# EAGLE design breadboard_isp (EAGLE 6.1)
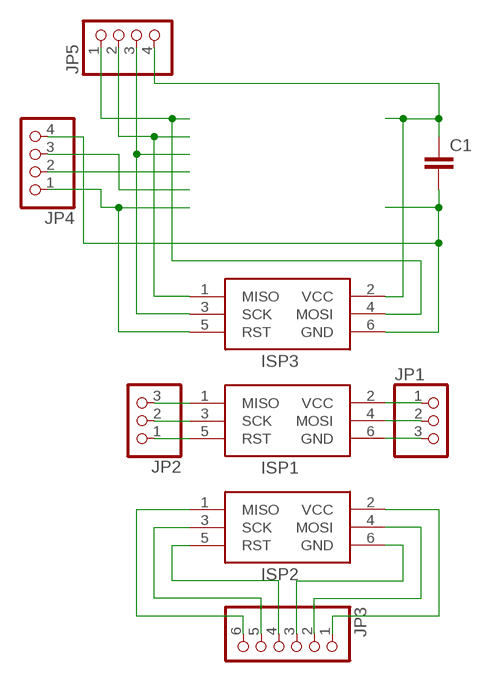
[diagram p0: schematic, sheet 1]

## Parts
C1  C-EU025-025X050  [C025-025X050]
ISP1  AVRISP-6  [AVRISP]
ISP2  AVRISP-6  [AVRISP]
ISP3  AVRISP-6  [AVRISP]
JP1  PINHD-1X3  [1X03]
JP2  PINHD-1X3  [1X03]
JP3  PINHD-1X6  [1X06]
JP4  PINHD-1X4  [1X04]
JP5  PINHD-1X4  [1X04]

## Nets
N$1: ISP1.5(RST) JP2.1
N$2: ISP1.3(SCK) JP2.2
N$3: ISP1.1(MISO) JP2.3
N$4: ISP1.2(VCC) JP1.1
N$5: ISP1.4(MOSI) JP1.2
N$6: ISP1.6(GND) JP1.3
N$7: ISP2.5(RST) JP3.4
N$8: ISP2.6(GND) JP3.3
N$9: ISP2.4(MOSI) JP3.2
N$10: ISP2.3(SCK) JP3.5
N$11: ISP2.1(MISO) JP3.6
N$12: ISP2.2(VCC) JP3.1
N$13: C1.1 ISP3.2(VCC) JP5.4
N$14: C1.2 ISP3.6(GND) JP4.4
N$15: ISP3.4(MOSI) JP5.1
N$16: ISP3.1(MISO) JP5.2
N$17: ISP3.3(SCK) JP5.3
N$18: ISP3.5(RST) JP4.1
N$19: JP4.2
N$20: JP4.3

## Library data of the parts
C1 = rcl:C-EU: CAPACITOR, European symbol
ISP1-ISP3 = adafruit:AVRISP: AVR ISP HEADER Standard 6 pin header for AVR programming
JP1 JP2 = pinhead:PINHD-1X3: PIN HEADER
JP3 = pinhead:PINHD-1X6: PIN HEADER
JP4 JP5 = pinhead:PINHD-1X4: PIN HEADER

## Board
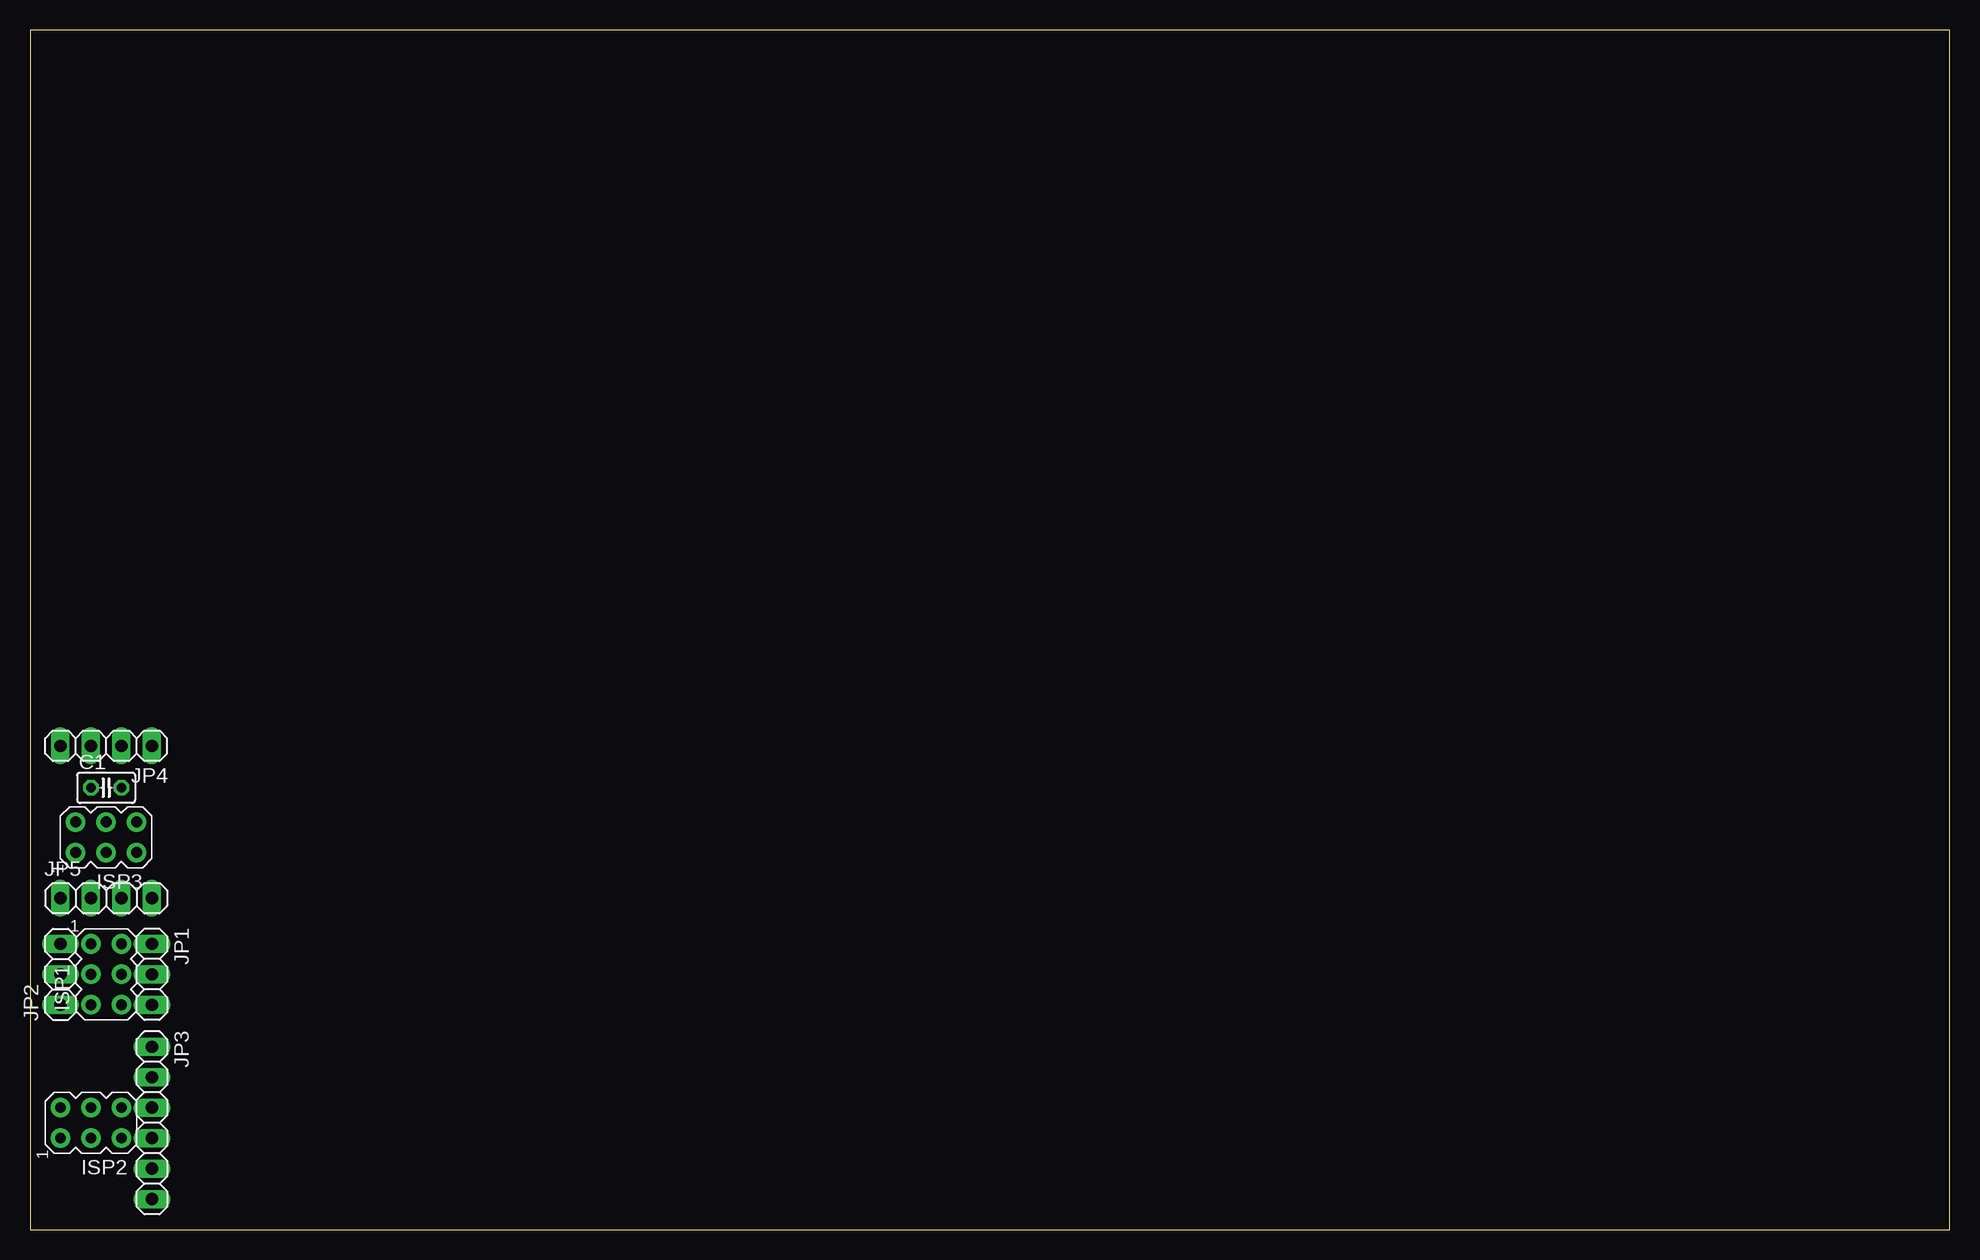
[diagram p1: board, top side]
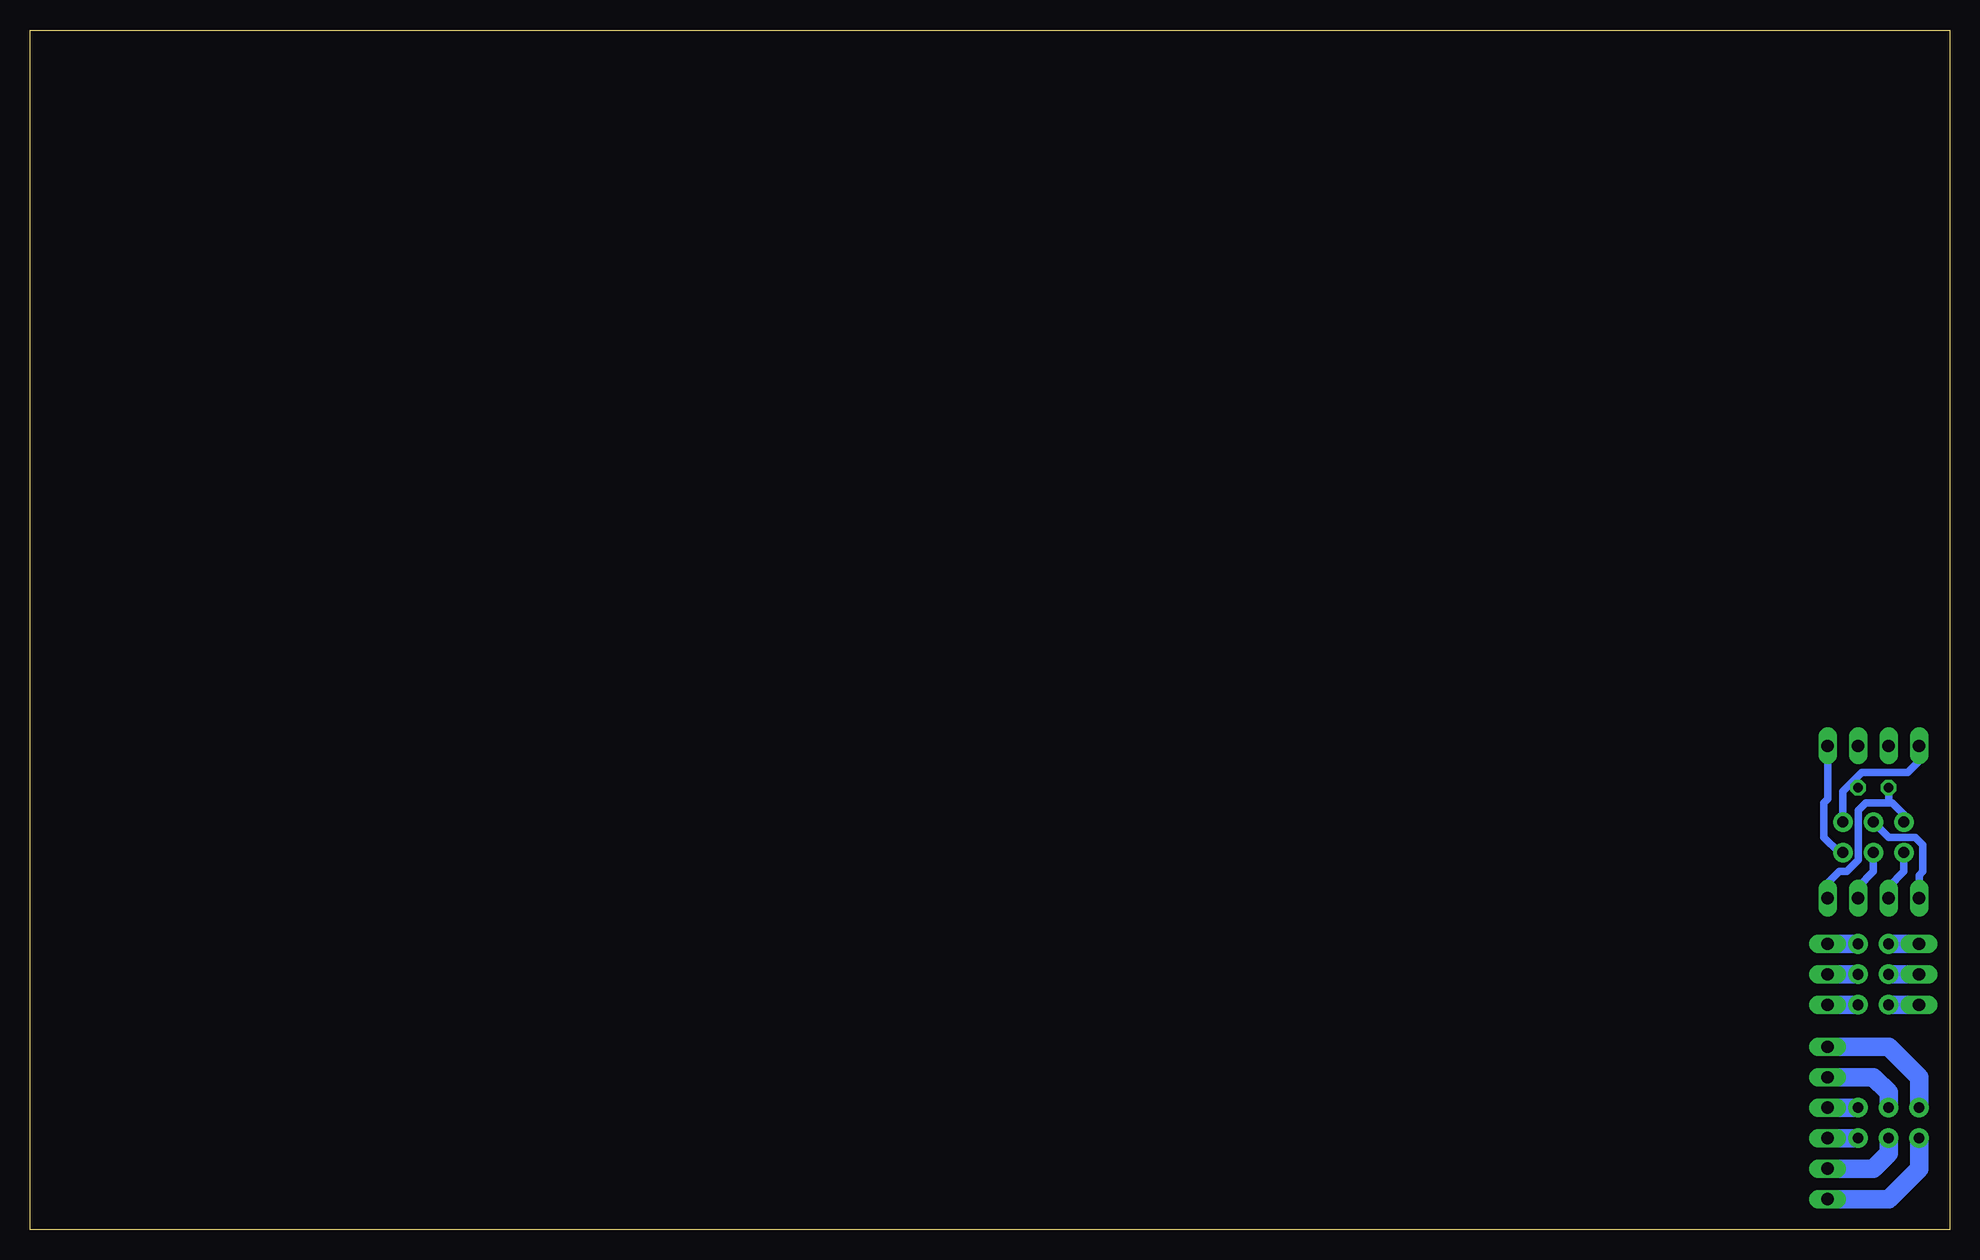
[diagram p2: board, bottom side, seen from below]

Size 160 x 100 mm. Coordinates in mm from the lower left corner, seen from the top.
Outline: 0,0 160,0 160,100 0,100 0,0
Copper layers (1*16): Top 0.035mm / dielectric 1.5mm / Bottom 0.035mm
Design rules: minimum track width 10mil, minimum drill 24mil, track to track 8mil, track to pad 8mil, pad to pad 8mil, via to via 8mil, smd to smd 8mil, copper to edge 40mil, drill to drill 8mil, minimum pad ring 10mil, minimum via ring 8mil, stop-mask expansion 4mil, vias tented up to drill 0mil, thermal gap 10mil

### Footprints (pad centres in the part's own frame; a part is rotated, then mirrored left to right if it is on the bottom)
C025-025X050 = drill 0.813 octagon: 1 -1.27,0; 2 1.27,0
AVRISP = drill 0.9 pad 1.626: 1 -1.27,2.54; 2 1.27,2.54; 3 -1.27,0; 4 1.27,0; 5 -1.27,-2.54; 6 1.27,-2.54
1X03 = drill 1.016 long: 1 -2.54,0; 2 0,0; 3 2.54,0
1X06 = drill 1.016 long: 1 -6.35,0; 2 -3.81,0; 3 -1.27,0; 4 1.27,0; 5 3.81,0; 6 6.35,0
1X04 = drill 1.016 long: 1 -3.81,0; 2 -1.27,0; 3 1.27,0; 4 3.81,0

### Placement (x,y rotation side)
C1  6.35,36.83 0 top
ISP1  6.35,21.27 0 top
ISP2  5.08,8.89 90 top
ISP3  6.35,32.7 90 top
JP1  10.16,21.27 270 top
JP2  2.54,21.27 90 top
JP3  10.16,8.89 270 top
JP4  6.35,40.32 180 top
JP5  6.35,27.62 0 top

### Tracks (layer width: path | path; a pad name or v marks a point on that pad's centre or on a via)
N$1
  Bottom 1.524: JP2.1 ISP1.5
N$2
  Bottom 1.524: ISP1.3 JP2.2
N$3
  Bottom 1.524: JP2.3 ISP1.1
N$4
  Bottom 1.524: ISP1.2 JP1.1
N$5
  Bottom 1.524: JP1.2 ISP1.4
N$6
  Bottom 1.524: ISP1.6 JP1.3
N$7
  Bottom 1.524: ISP2.5 JP3.4
N$8
  Bottom 1.524: ISP2.6 JP3.3
N$9
  Bottom 1.524: ISP2.4 5.08,11.43 6.35,12.7 JP3.2
N$10
  Bottom 1.524: ISP2.3 5.08,6.35 6.35,5.08 JP3.5
N$11
  Bottom 1.524: ISP2.1 2.54,5.08 5.08,2.54 JP3.6
N$12
  Bottom 1.524: ISP2.2 2.54,12.7 5.08,15.24 JP3.1
N$13
  Bottom 0.61: JP5.4 10.16,28.89 9.21,29.84 8.57,29.84 7.62,30.8 7.62,34.92 6.99,35.56 5.08,35.56 | C1.1 5.08,35.56 | 5.08,35.56 4.76,35.56 3.81,34.61 ISP3.2
N$14
  Bottom 0.61: ISP3.6 8.89,36.51 8.1,37.31 | 8.1,37.31 7.3,38.1 3.49,38.1 2.54,39.05 JP4.4 | C1.2 8.1,37.31
N$15
  Bottom 0.61: ISP3.4 5.08,32.7 2.86,32.7 2.22,32.07 2.22,29.84 2.54,29.53 JP5.1
N$16
  Bottom 0.61: JP5.2 5.08,28.57 3.81,29.84 ISP3.1
N$17
  Bottom 0.61: JP5.3 7.62,28.57 6.35,29.84 ISP3.3
N$18
  Bottom 0.61: ISP3.5 9.21,31.43 10.48,32.7 10.48,35.56 10.16,35.88 JP4.1